# EAGLE design espbreakoutprograming jig (EAGLE 7.2.0)
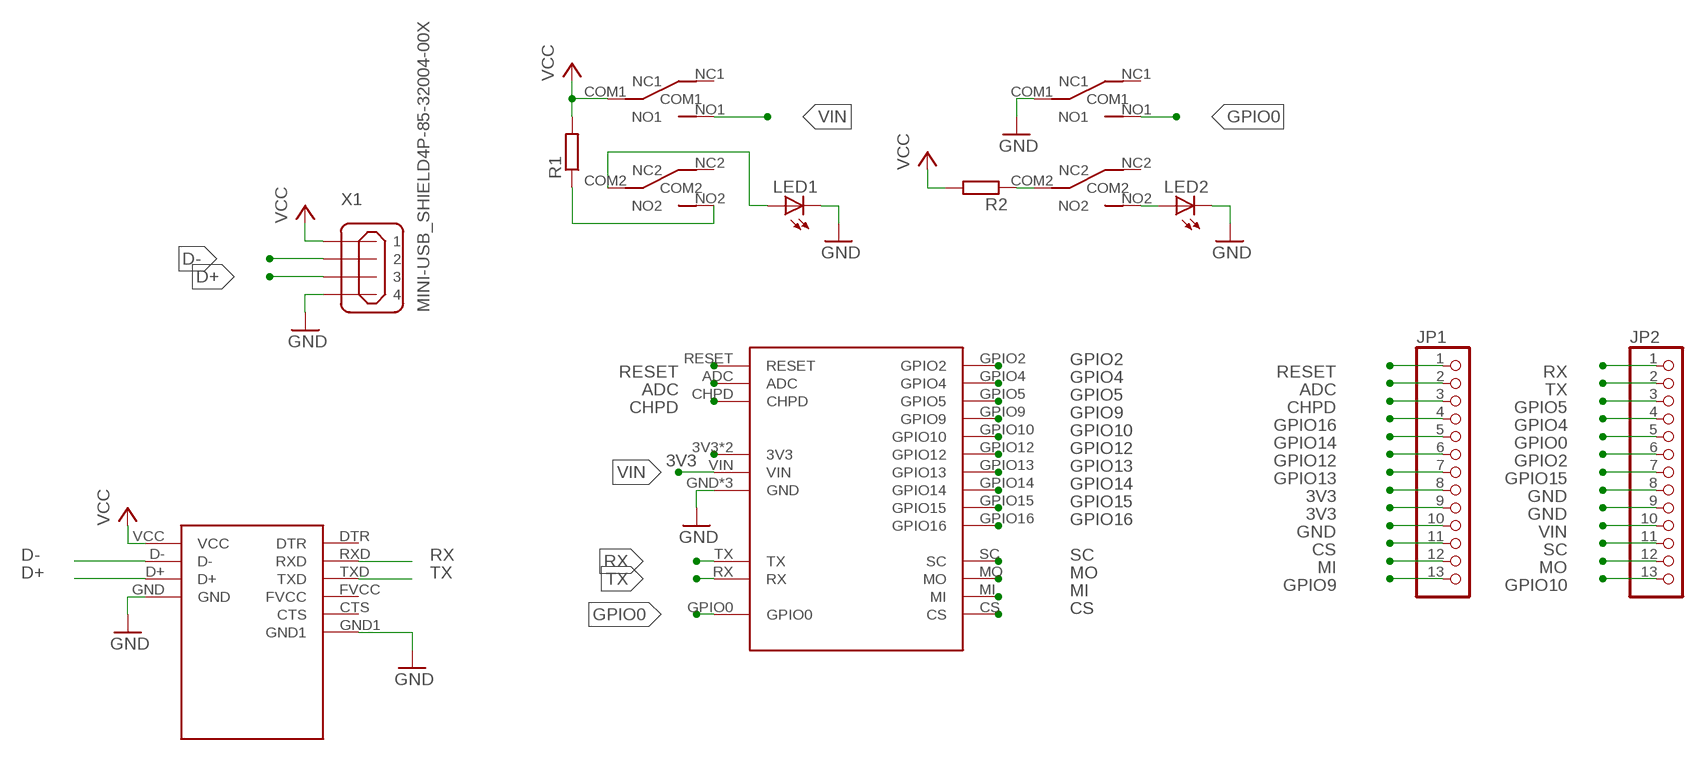
[diagram p0: schematic, sheet 1]

## Parts
FLASH  TOGGLE_SWITCH  [7MMX7MM]
JP1  PINHD-1X13  [1X13]
JP2  PINHD-1X13  [1X13]
LED1  LED5MM  [LED5MM]
LED2  LED5MM  [LED5MM]
POWER  TOGGLE_SWITCH  [7MMX7MM]
R1  R-EU_0207/10  [0207/10]
R2  R-EU_0207/10  [0207/10]
U$1  USB-TTL  [USB_TTL]
U$2  ESP12EBREAKOUT  [ESP12EBREAKOUT]
X1  MINI-USB_SHIELD4P-85-32004-00X  [85-32004-00X]

## Nets
3V3: JP1.8 JP1.9 U$2.3V3 U$2.3V3_2(3V3)
ADC: JP1.2 U$2.ADC
CHPD: JP1.3 U$2.CHPD
CS: JP1.11 U$2.CS
D+: U$1.D+ X1.3
D-: U$1.D- X1.2
GND: FLASH.COM1 JP1.10 JP2.8 JP2.9 LED1.K(C) LED2.K(C) U$1.GND U$1.GND1 U$2.GND U$2.GND_2(GND) U$2.GND_3(GND) X1.4
GPIO0: FLASH.NO1 JP2.5 U$2.GPIO0
GPIO2: JP2.6 U$2.GPIO2
GPIO4: JP2.4 U$2.GPIO4
GPIO5: JP2.3 U$2.GPIO5
GPIO9: JP1.13 U$2.GPIO9
GPIO10: JP2.13 U$2.GPIO10
GPIO12: JP1.6 U$2.GPIO12
GPIO13: JP1.7 U$2.GPIO13
GPIO14: JP1.5 U$2.GPIO14
GPIO15: JP2.7 U$2.GPIO15
GPIO16: JP1.4 U$2.GPIO16
MI: JP1.12 U$2.MI
MO: JP2.12 U$2.MO
N$4: POWER.NO2 R1.1
N$5: LED1.A POWER.COM2
N$8: FLASH.COM2 R2.1
N$9: FLASH.NO2 LED2.A
RESET: JP1.1 U$2.RESET
RX: JP2.1 U$1.RXD U$2.TX
SC: JP2.11 U$2.SC
TX: JP2.2 U$1.TXD U$2.RX
VCC: POWER.COM1 R1.2 R2.2 U$1.VCC X1.1
VIN: JP2.10 POWER.NO1 U$2.VIN
Unconnected: FLASH.NC1 FLASH.NC2 POWER.NC1 POWER.NC2 U$1.CTS U$1.DTR U$1.FVCC X1.M1(S1) X1.M2(S2)

## Library data of the parts
FLASH POWER = mylib:TOGGLE_SWITCH
JP1 JP2 = pinhead:PINHD-1X13: PIN HEADER
LED1 LED2 = adafruit:LED: LED OSRAM: - CHIPLED LG R971, LG N971, LY N971, LG Q971, LY Q971, LO R971, LY R971 LH N974, LH R974 LS Q976, LO Q976, LY Q976 LO Q996 - Hyper CHIPLED LW Q18S LB Q993, LB Q99A, LB R99A - SideLED LS A670, LO A670, LY A670, LG A670, LP A670 LB A673, LV A673, LT A673, LW A673 LH A674 LY A675 LS A676, LA A676, LO A676, LY A676, LW A676 LS A679, LY A679, LG A679 - Hyper Micro SIDELED® LS Y876, LA Y876, LO Y876, LY Y876 LT Y87S - SmartLED LW L88C, LW L88S LB L89C, LB L89S, LG L890 LS L89K, LO L89K, LY L89K LS L896, LA L896, LO L896, LY L896 - TOPLED LS T670, LO T670, LY T670, LG T670, LP T670 LSG T670, LSP T670, LSY T670, LOP T670, LYG T670 LG T671, LOG T671, LSG T671 LB T673, LV T673, LT T673, LW T673 LH T674 LS T676, LA T676, LO T676, LY T676, LB T676, LH T676, LSB T676, LW T676 LB T67C, LV T67C, LT T67C, LS T67K, LO T67K, LY T67K, LW E67C LS E67B, LA E67B, LO E67B, LY E67B, LB E67C, LV E67C, LT E67C LW T67C LS T679, LY T679, LG T679 LS T770, LO T770, LY T770, LG T770, LP T770 LB T773, LV T773, LT T773, LW T773 LH T774 LS E675, LA E675, LY E675, LS T675 LS T776, LA T776, LO T776, LY T776, LB T776 LHGB T686 LT T68C, LB T68C - Hyper Mini TOPLED® LB M676 - Mini TOPLED Santana® LG M470 LS M47K, LO M47K, LY M47K Source: http://www.osram.convergy.de/
R1 R2 = rcl:R-EU_: RESISTOR, European symbol
U$1 = mylib:USB-TTL
U$2 = mylib:ESP12EBREAKOUT
X1 = con-cypressindustries:MINI-USB_SHIELD4P-: MINI USB 4 Pol. Source: www.cypressindustries.com; OC_FARNELL: unknown; OC_NEWARK: unknown

## Board
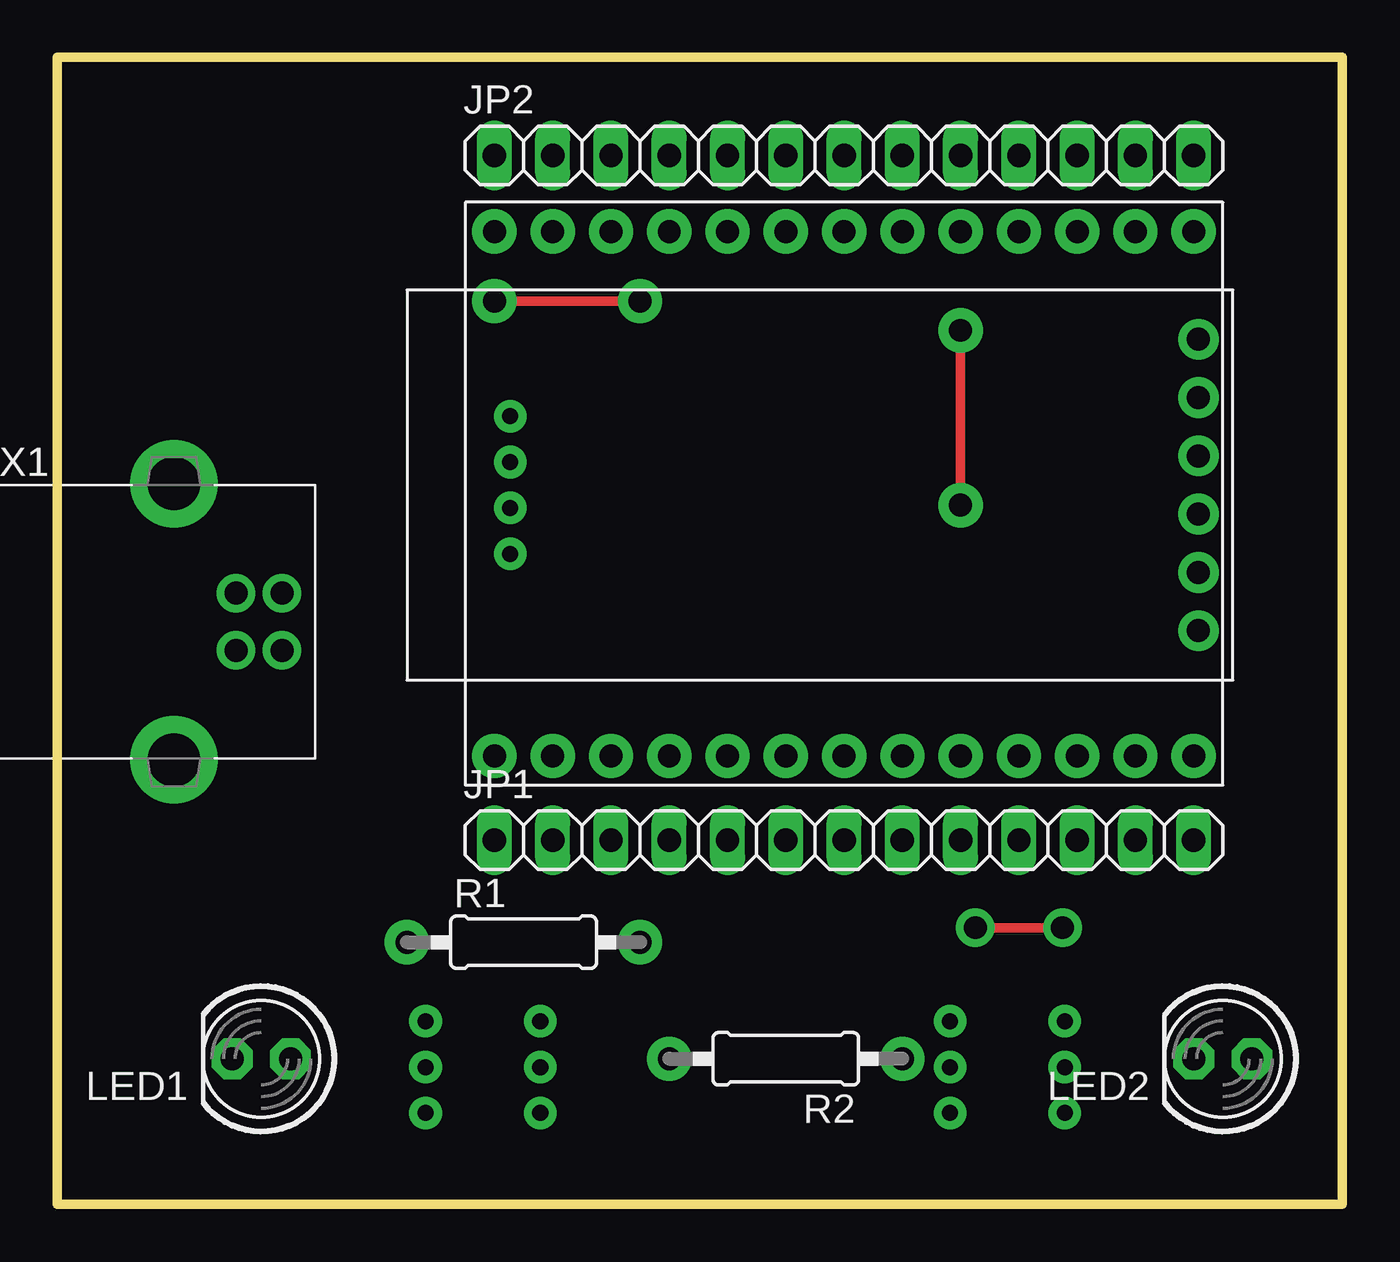
[diagram p1: board, top side]
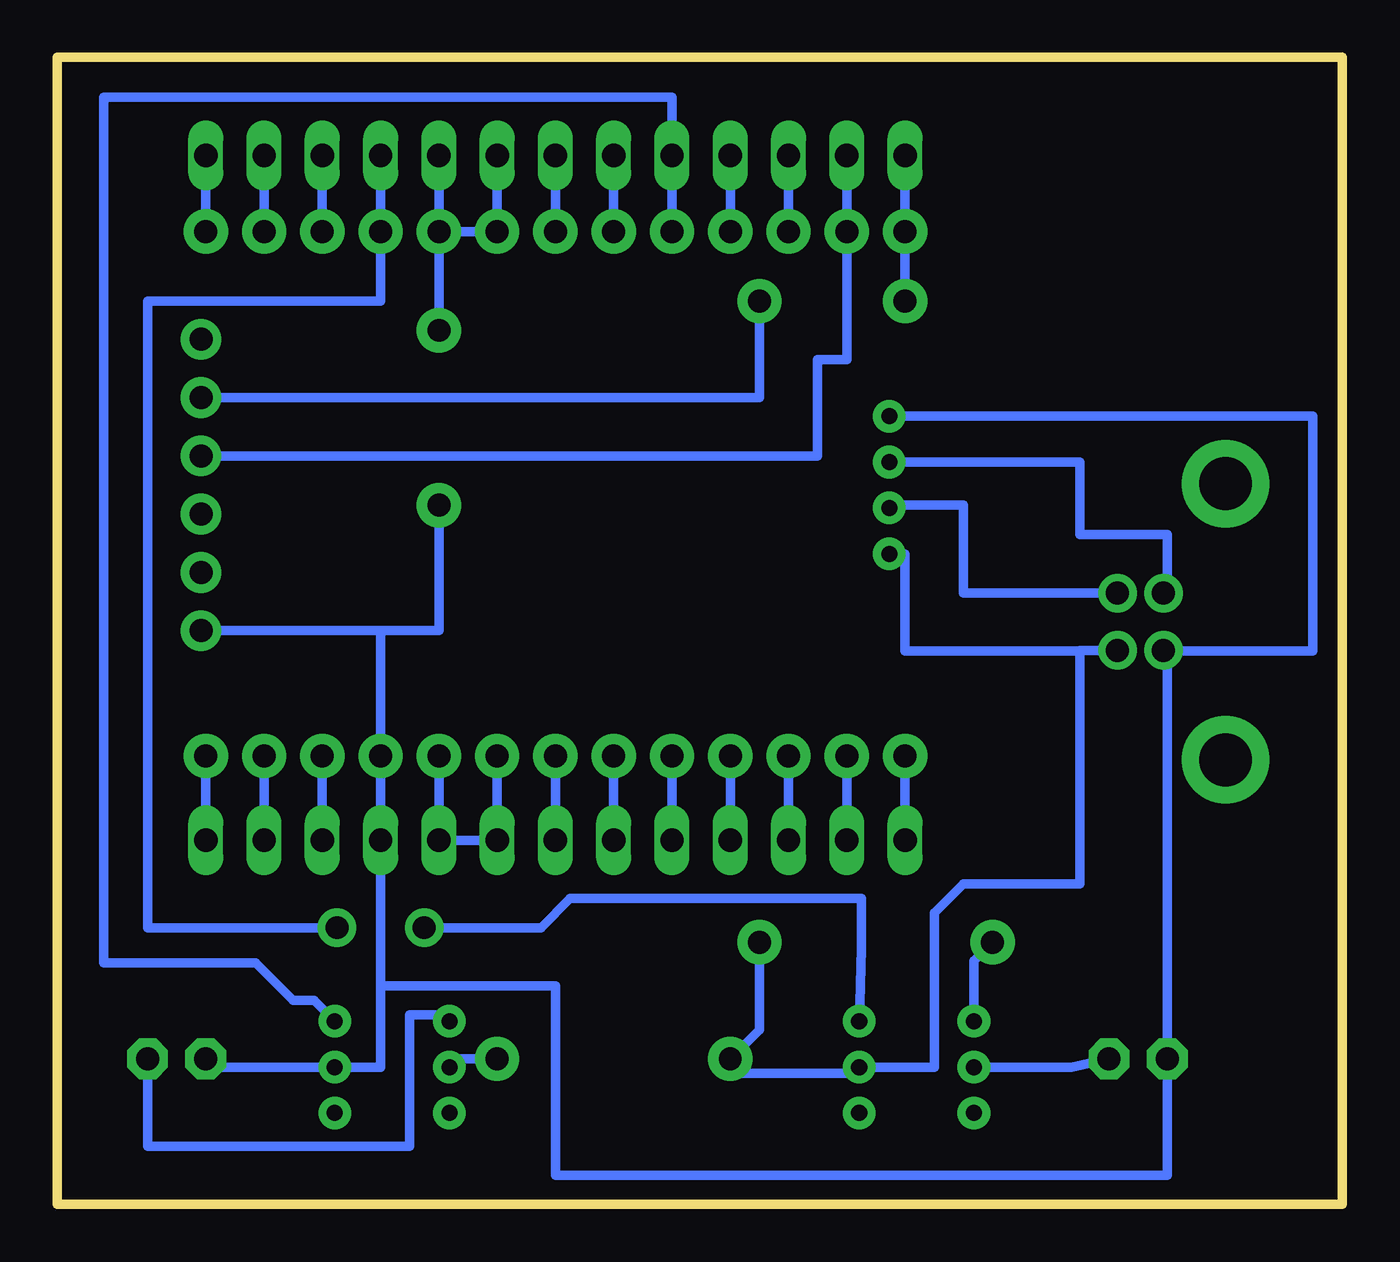
[diagram p2: board, bottom side, seen from below]

Size 56 x 50 mm. Coordinates in mm from the lower left corner, seen from the top.
Outline: 0,0 56,0 56,50 0,50 0,0
Copper layers (1*16): Top 0.035mm / dielectric 1.5mm / Bottom 0.035mm
Design rules "default": minimum track width 10mil, minimum drill 24mil, track to track 8mil, track to pad 8mil, pad to pad 8mil, via to via 8mil, smd to smd 8mil, copper to edge 40mil, drill to drill 8mil, minimum pad ring 10mil, minimum via ring 8mil, stop-mask expansion 4mil, vias tented up to drill 0mil, thermal gap 10mil
Milling: 4 lines

### Footprints (pad centres in the part's own frame; a part is rotated, then mirrored left to right if it is on the bottom)
7MMX7MM = drill 0.7 pad 1.422: COM1 -2,1; COM2 3,1; NC1 -2,3; NC2 3,3; NO1 -2,-1; NO2 3,-1
1X13 = drill 1.016 long: 1 -15.24,0; 2 -12.7,0; 3 -10.16,0; 4 -7.62,0; 5 -5.08,0; 6 -2.54,0; 7 0,0; 8 2.54,0; 9 5.08,0; 10 7.62,0; 11 10.16,0; 12 12.7,0; 13 15.24,0
LED5MM = drill 1 pad 1.778 octagon: A -1.27,0; K 1.27,0
0207/10 = drill 1 pad 1.93: 1 -5.08,0; 2 5.08,0
USB_TTL = drill 1 pad 1.778: CTS 34.5,4.69; DTR 34.5,14.85; FVCC 34.5,7.23; GND1 34.5,2.15; RXD 34.5,12.31; TXD 34.5,9.77 | drill 0.7 pad 1.422: D+ 4.5,9.5; D- 4.5,7.5; GND 4.5,11.5; VCC 4.5,5.5
ESP12EBREAKOUT = drill 1 pad 1.93: 3V3 -8.89,2.54; 3V3_2 -8.89,0; ADC -8.89,17.78; CHPD -8.89,15.24; CS -8.89,-5.08; GND -8.89,-2.54; GND_2 13.97,0; GND_3 13.97,2.54; GPIO0 13.97,10.16; GPIO2 13.97,7.62; GPIO4 13.97,12.7; GPIO5 13.97,15.24; GPIO9 -8.89,-10.16; GPIO10 13.97,-10.16; GPIO12 -8.89,7.62; GPIO13 -8.89,5.08; GPIO14 -8.89,10.16; GPIO15 13.97,5.08; GPIO16 -8.89,12.7; MI -8.89,-7.62; MO 13.97,-7.62; RESET -8.89,20.32; RX 13.97,17.78; SC 13.97,-5.08; TX 13.97,20.32; VIN 13.97,-2.54
85-32004-00X = drill 1 pad 1.676: 1 4.71,-1.25; 2 4.71,1.25; 3 2.71,1.25; 4 2.71,-1.25 | drill 2.3 pad 3.81: M1 0,6.02; M2 0,-6.02

### Placement (x,y rotation side)
FLASH  41.91,6.99 180 top
JP1  34.29,15.88 0 top
JP2  34.29,45.72 0 top
LED1  8.89,6.35 180 top
LED2  50.8,6.35 180 top
POWER  19.05,6.99 180 top
R1  20.32,11.43 0 top
R2  31.75,6.35 180 top
U$1  15.24,22.86 0 top
U$2  39.37,28.44 90 top
X1  5.08,25.4 0 top

### Tracks (layer width: path | path; a pad name or v marks a point on that pad's centre or on a via)
3V3
  Bottom 0.406: U$2.3V3 JP1.8 JP1.9 U$2.3V3_2
ADC
  Bottom 0.406: JP1.2 U$2.ADC
CHPD
  Bottom 0.406: U$2.CHPD JP1.3
CS
  Bottom 0.406: U$2.CS JP1.11
D+
  Bottom 0.406: X1.3 7.62,26.65 7.62,29.21 11.43,29.21 11.43,32.36 U$1.D+
D-
  Bottom 0.406: X1.2 16.51,26.65 16.51,30.48 19.74,30.48 U$1.D-
GND  (via drill 1 pad 1.93)
  Top 0.406: v39.37,30.48 v39.37,38.1
  Bottom 0.406: LED2.K 49.53,5.99 FLASH.COM1 41.91,5.99 41.91,9.53 | 41.91,9.53 34.29,9.53 34.29,1.27 7.62,1.27 LED1.K 7.62,24.15 X1.4 7.79,24.13 1.27,24.13 1.27,34.36 U$1.GND | 41.91,9.53 JP1.10 U$2.GND 41.91,25.01 | U$2.GND_2 U$2.GND_3 JP2.8 | JP2.9 U$2.GND_2 | U$1.GND1 41.91,25.01 | 41.91,25.01 39.37,25.01 v39.37,30.48 | U$2.GND_2 v39.37,38.1
GPIO0
  Bottom 0.406: U$2.GPIO0 JP2.5 29.21,48.26 53.98,48.26 53.98,10.53 47.35,10.53 45.72,8.89 44.81,8.89 FLASH.NO1
GPIO2
  Bottom 0.406: JP2.6 U$2.GPIO2
GPIO4
  Bottom 0.406: JP2.4 U$2.GPIO4
GPIO5
  Bottom 0.406: JP2.3 U$2.GPIO5
GPIO9
  Bottom 0.406: U$2.GPIO9 JP1.13
GPIO10
  Bottom 0.406: JP2.13 U$2.GPIO10
GPIO12
  Bottom 0.406: U$2.GPIO12 JP1.6
GPIO13
  Bottom 0.406: U$2.GPIO13 JP1.7
GPIO14
  Bottom 0.406: U$2.GPIO14 JP1.5
GPIO15
  Bottom 0.406: JP2.7 U$2.GPIO15
GPIO16
  Bottom 0.406: U$2.GPIO16 JP1.4
MI
  Bottom 0.406: U$2.MI JP1.12
MO
  Bottom 0.406: JP2.12 U$2.MO
N$4
  Bottom 0.406: POWER.NO2 16.05,10.62 R1.1
N$5
  Bottom 0.406: POWER.COM2 11.79,5.99 LED1.A
N$8
  Bottom 0.406: R2.1 38.91,6.35 FLASH.COM2
N$9
  Bottom 0.406: LED2.A 52.07,2.54 40.64,2.54 40.64,8.26 38.91,8.26 FLASH.NO2
RESET
  Bottom 0.406: JP1.1 U$2.RESET
RX  (via drill 1 pad 1.93)
  Top 0.406: v25.4,39.37 v19.05,39.37
  Bottom 0.406: JP2.1 U$2.TX v19.05,39.37 | U$1.RXD 25.4,35.17 v25.4,39.37
SC
  Bottom 0.406: JP2.11 U$2.SC
TX
  Bottom 0.406: JP2.2 U$2.RX 21.59,36.83 22.86,36.83 22.86,32.63 U$1.TXD
VCC
  Bottom 0.406: 11.43,24.13 11.43,13.97 16.51,13.97 17.78,12.7 17.78,5.99 POWER.COM1 21.05,5.71 26.67,5.71 R2.2 25.4,7.62 R1.2 | X1.1 11.43,24.15 11.43,24.13 | U$1.VCC 19.05,28.36 19.05,24.13 11.43,24.13
VIN  (via drill 1 pad 1.68)
  Top 0.406: v40.01,12.06 v43.81,12.06
  Bottom 0.406: POWER.NO1 20.95,11.16 20.95,13.34 33.66,13.34 34.92,12.06 v40.01,12.06 | v43.81,12.06 52.07,12.06 52.07,39.37 41.91,39.37 U$2.VIN JP2.10